# Altium project ARDUINO.PrjPcb (part 2 of 3)
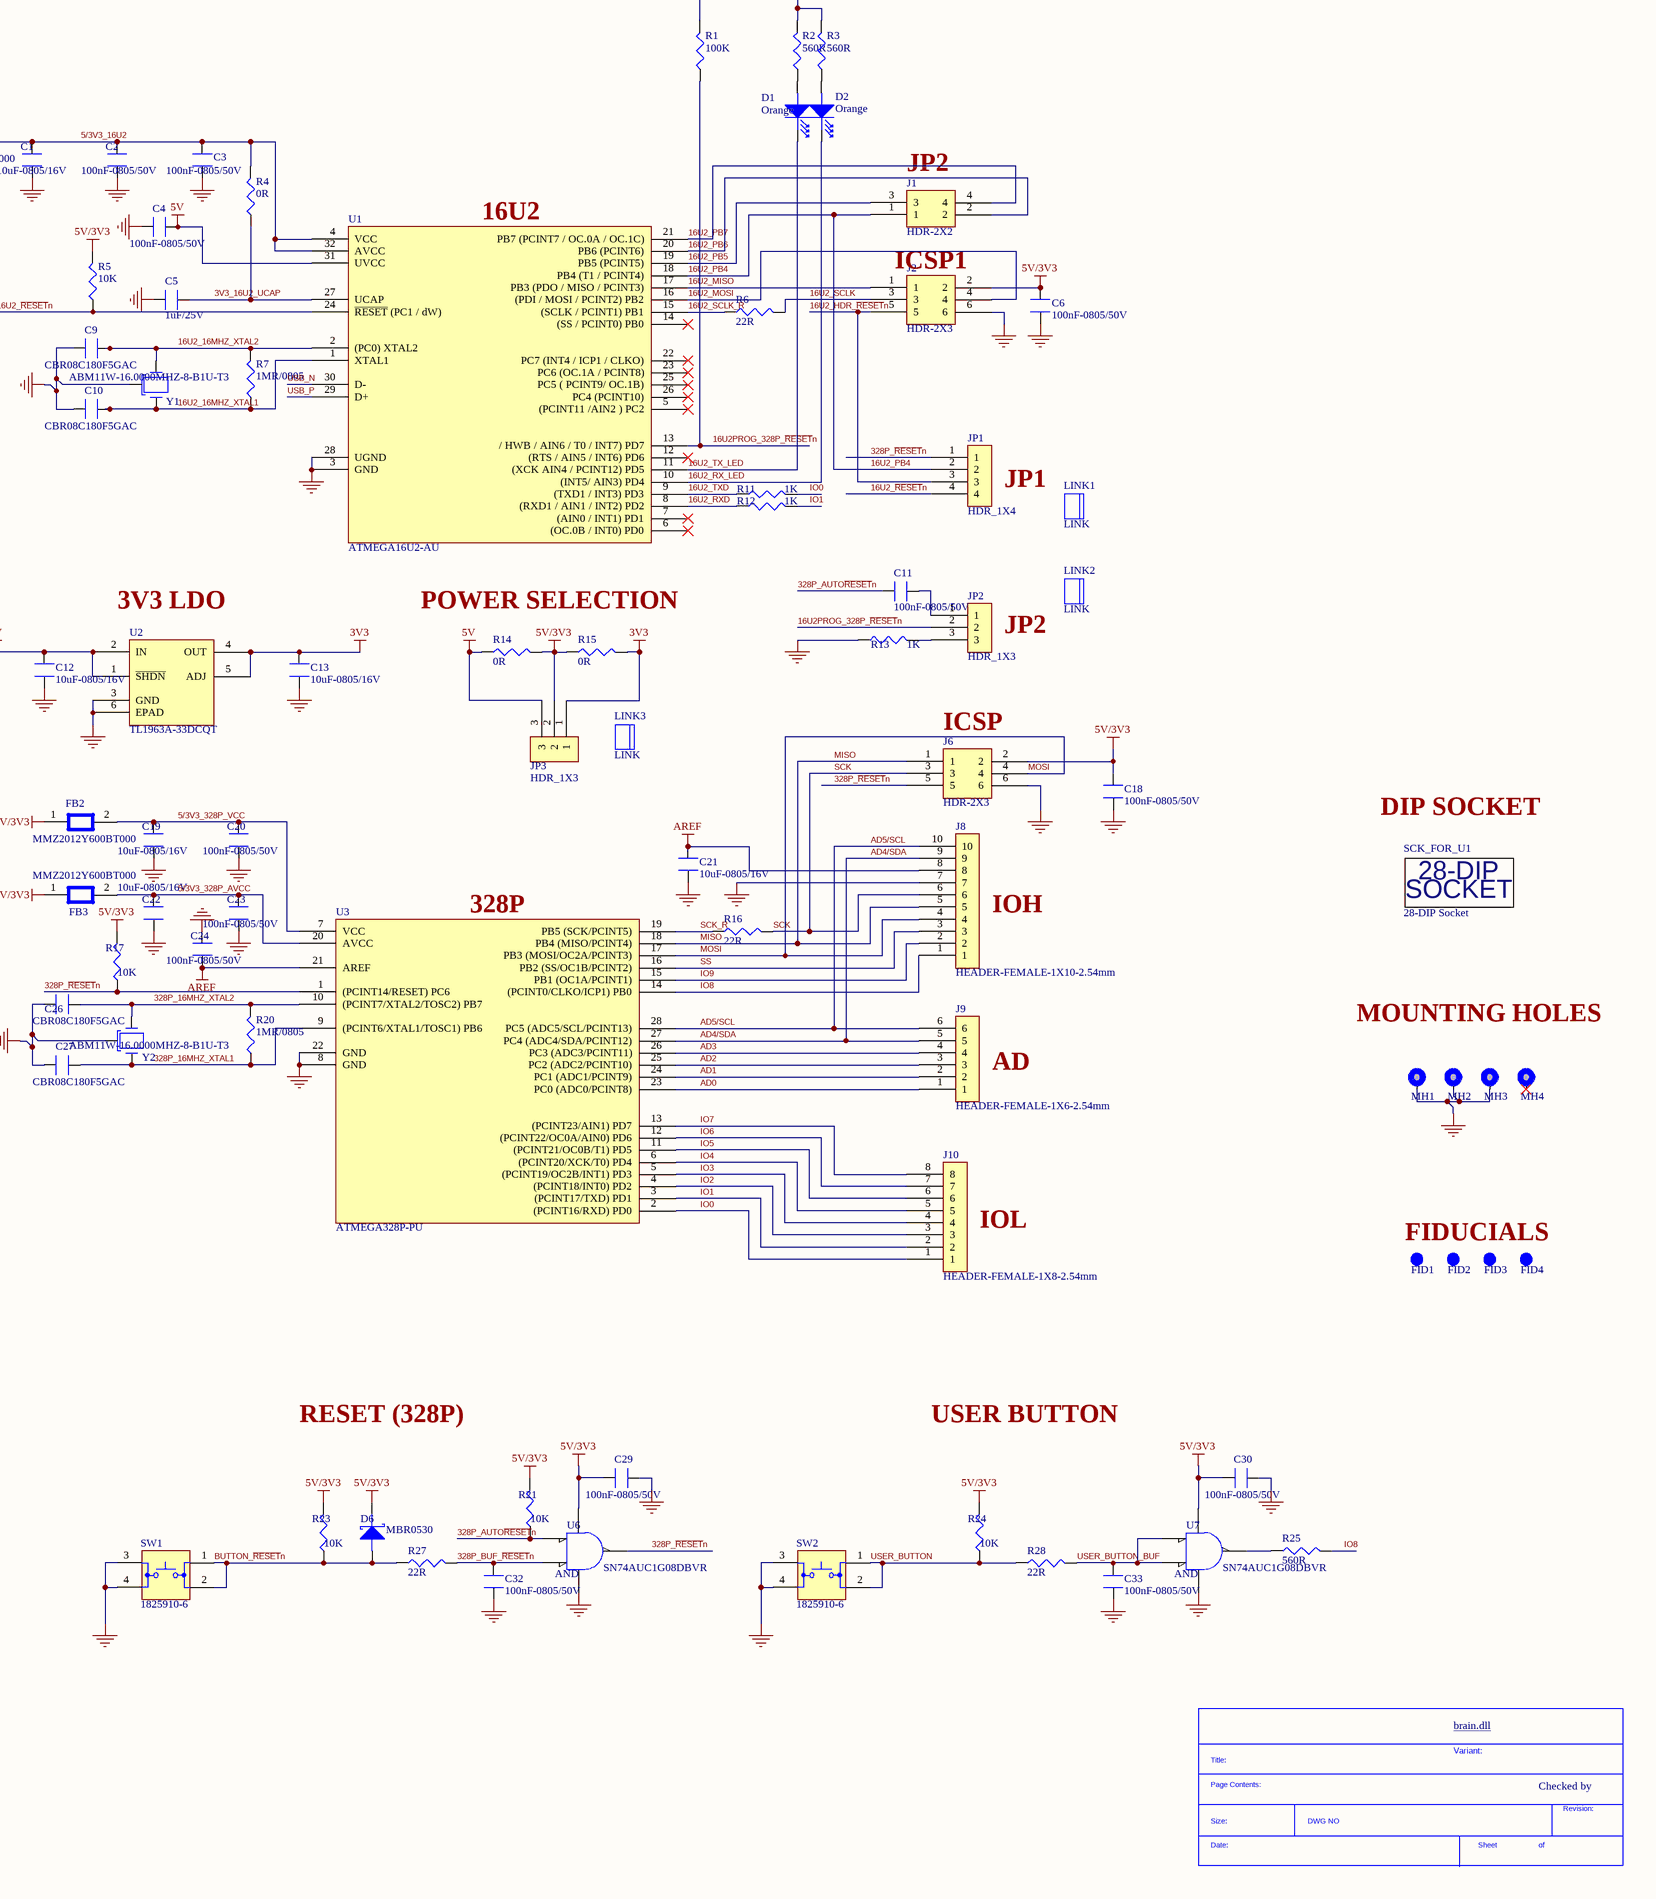
[diagram p6: [03] - 28PINS SCHEMATIC.SchDoc, bottom right]

## Sheet [03] - 28PINS SCHEMATIC.SchDoc: ARDUINO-28PIN (continued)
### Library data of the parts
C1 C12 C13 C17 C19 C21 C22 = C2012X5R1C106M085AC: TDK - C2012X5R1C106M085AC - SMD Multilayer Ceramic Capacitor, 10 µF, 16 V, 0805 [2012 Metric], ± 20%, X5R, C Series TDK; Capacitance: 10uF; Voltage Rating: 16V; Supplier 1: Digi-Key; Manufacturer: TDK; Manufacturer Part Number: C2012X5R1C106M085AC; RoHS: Yes; Category: Ceramic Capacitors; Stock 1: 53928; Pricing 1: 1=0,29000, 10=0,19800, 50=0,11900, 100=0,10050, 500=0,06876, 1000=0,06084 (USD); Mount: Surface Mount; Case/Package: 0805; Number of Pins: 2; Case Code (Metric): 2012; Case Code (Imperial): 0805; Weight: 0.000194oz; Dielectric Material: Ceramic; Min Operating Temperature: -55°C; Max Operating Temperature: 85°C; Packaging: Tape and Reel; Tolerance: 20%; Termination: SMD/SMT; Voltage Rating (DC): 16V; Package Quantity: 4000; Resistor Type: Ceramic; Dielectric: X5R; Voltage: 16V; Length: 2mm; Width: 0.049inch; Height: 0.85mm; Thickness: 0.037inch; Depth: 1.25mm; Lead Free: Lead Free; REACH SVHC: No SVHC; ComponentLink1URL: https://datasheet.ciiva.com/24218/c2012x5r1c106m085ac-265002-24218340.pdf?src-supplier=Mouser; ComponentLink1Description: https://datasheet.ciiva.com/24218/c2012x5r1c106m085ac-265002-24218340.pdf?src-supplier=Mouser; ComponentLink2URL: https://datasheet.ciiva.com/11788/0900766b80c1bb00-11788108.pdf?src-supplier=RSComponents; ComponentLink2Description: https://datasheet.ciiva.com/11788/0900766b80c1bb00-11788108.pdf?src-supplier=RSComponents; ComponentLink3URL: https://datasheet.ciiva.com/6290/tdkmlcccaprange-6290485.pdf?src-supplier=Digi-Key; ComponentLink3Description: https://datasheet.ciiva.com/6290/tdkmlcccaprange-6290485.pdf?src-supplier=Digi-Key; ComponentLink4URL: https://datasheet.ciiva.com/22725/1913358-22725557.pdf?src-supplier=Element14; ComponentLink4Description: https://datasheet.ciiva.com/22725/1913358-22725557.pdf?src-supplier=Element14; ComponentLink5URL: https://datasheet.ciiva.com/6290/tdkmlcccaprange-6290487.pdf?src-supplier=Digi-Key; ComponentLink5Description: https://datasheet.ciiva.com/6290/tdkmlcccaprange-6290487.pdf?src-supplier=Digi-Key; ComponentLink6URL: https://datasheet.ciiva.com/16449/e412-c-16449591.pdf?src-supplier=Future+Electronics; ComponentLink6Description: https://datasheet.ciiva.com/16449/e412-c-16449591.pdf?src-supplier=Future+Electronics; ComponentLink7URL: https://datasheet.ciiva.com/23803/1796654-23803021.pdf?src-supplier=Newark; ComponentLink7Description: https://datasheet.ciiva.com/23803/1796654-23803021.pdf?src-supplier=Newark; Supplier Part Number 1: 445-7645-1-ND
C2-C4 C6 C11 C14-C16 C18 C20 C23-C25 C28-C33 = C2012X7R1H104K125AE: Ceramic Capacitor, Multilayer, Ceramic, 50V, 10% +Tol, 10% -Tol, X7R, 15% TC, 0.1uF, Surface Mount, 0805; Manufacturer: TDK; Capacitance: 100nF; Supplier 1: Digi-Key; Manufacturer Part Number: C2012X7R1H104K125AE; RoHS: Yes; Category: Ceramic Capacitors; Stock 1: 3200; Pricing 1: 1=0,25000, 10=0,17200, 50=0,11440, 100=0,09720, 500=0,06864, 1000=0,06006 (USD); Mount: Surface Mount; Case/Package: 0805; Case Code (Metric): 2012; Case Code (Imperial): 0805; Weight: 0.000194oz; Min Operating Temperature: -55°C; Max Operating Temperature: 125°C; Package Quantity: 2000; Packaging: Tape and Reel; Tolerance: 10%; Voltage Rating: 50V; Dielectric: X7R; Termination: SMD/SMT; Voltage Rating (DC): 50V; Features: Soft Termination; Length: 0.079inch; Width: 0.049inch; Height: 1.25mm; Thickness: 0.057inch; RoHS Compliant: Yes; ComponentLink1URL: https://datasheet.ciiva.com/29534/mlcc-commercial-soft-en-29534235.pdf?src-supplier=Digi-Key; ComponentLink1Description: https://datasheet.ciiva.com/29534/mlcc-commercial-soft-en-29534235.pdf?src-supplier=Digi-Key; Supplier Part Number 1: 445-15929-1-ND
C5 = CGB4B3JB1E105K055AB: CAP CER 1UF 25V JB 0805; Manufacturer: TDK; Tolerance: 10%; Supplier 1: Digi-Key; Manufacturer Part Number: CGB4B3JB1E105K055AB; RoHS: Yes; Category: Ceramic Capacitors; Stock 1: 9451; Pricing 1: 1=0,38000, 10=0,26200, 50=0,17480, 100=0,14860, 500=0,10488, 1000=0,09177 (USD); Mount: Surface Mount; Case/Package: 0805; Case Code (Metric): 2012; Case Code (Imperial): 0805; Min Operating Temperature: -25°C; Max Operating Temperature: 85°C; Package Quantity: 4000; Packaging: Tape and Reel; Capacitance: 1uF; Voltage Rating: 25V; Series: CGB; Length: 0.079inch; Width: 0.049inch; Thickness: 0.022inch; RoHS Compliant: Yes; ComponentLink1URL: http://www.mouser.com/ds/2/400/tdk_mlcc_commercial_general_en-542463.pdf?src-supplier=Mouser; ComponentLink1Description: http://www.mouser.com/ds/2/400/tdk_mlcc_commercial_general_en-542463.pdf?src-supplier=Mouser; ComponentLink2URL: http://product.tdk.com/en/catalog/datasheets/mlcc_commercial_lowprofile_en.pdf?src-supplier=Avnet; ComponentLink2Description: http://product.tdk.com/en/catalog/datasheets/mlcc_commercial_lowprofile_en.pdf?src-supplier=Avnet; ComponentLink3URL: https://product.tdk.com/info/en/catalog/datasheets/mlcc_commercial_lowprofile_en.pdf?src-supplier=Digi-Key; ComponentLink3Description: https://product.tdk.com/info/en/catalog/datasheets/mlcc_commercial_lowprofile_en.pdf?src-supplier=Digi-Key; ComponentLink4URL: https://product.tdk.com/info/en/documents/chara_sheet/CGB4B3JB1E105K055AB.pdf?src-supplier=Digi-Key; ComponentLink4Description: https://product.tdk.com/info/en/documents/chara_sheet/CGB4B3JB1E105K055AB.pdf?src-supplier=Digi-Key; Supplier Part Number 1: 445-13262-1-ND
C7 C8 = EEE-HA1A101AP: Cap Aluminum Lytic 100uF 10V 20% (8 X 6.2mm) SMD 110mA 1000h 105C T/R; Manufacturer: Panasonic; Life (Hours): 1000Hour; Polarity: Polar; Supplier 1: Digi-Key; Manufacturer Part Number: EEE-HA1A101AP; RoHS: Yes; Category: Aluminum Electrolytic Capacitors; Stock 1: 351; Pricing 1: 1=0,57000, 10=0,40100, 50=0,30340, 100=0,26430 (USD); Mount: Surface Mount; Case/Package: Radial; Min Operating Temperature: -40°C; Max Operating Temperature: 105°C; Capacitance: 100uF; Voltage Rating: 10V; Tolerance: 20%; Ripple Current: 110mA; Packaging: Tape and Reel; Package Quantity: 1000; Voltage Rating (DC): 10V; Termination: SMD/SMT; Series: Automotive, AEC-Q200, HA; Construction: Cylindrical; Diameter: 8mm; Length: 6.5mm; Height: 6.2mm; Height - Seated (Max): 0.244inch; Radiation Hardening: No; RoHS Compliant: Yes; ComponentLink1URL: https://datasheet.ciiva.com/24070/aba0000ce3-259063-24070870.pdf?src-supplier=Mouser; ComponentLink1Description: https://datasheet.ciiva.com/24070/aba0000ce3-259063-24070870.pdf?src-supplier=Mouser; ComponentLink2URL: https://datasheet.ciiva.com/11680/aba0000ce3-11680519.pdf?src-supplier=Avnet; ComponentLink2Description: https://datasheet.ciiva.com/11680/aba0000ce3-11680519.pdf?src-supplier=Avnet; Supplier Part Number 1: PCE4650CT-ND
C9 C10 C26 C27 = CBR08C180F5GAC: CAP CER 18PF 50V NP0 0805; Manufacturer: KEMET; Tolerance: 1%; Dielectric: C0G; Supplier 1: Digi-Key; Manufacturer Part Number: CBR08C180F5GAC; RoHS: Yes; Category: Ceramic Capacitors; Stock 1: 2495; Pricing 1: 1=1,11000, 10=0,84100, 50=0,69860, 100=0,60150, 500=0,46570, 1000=0,40102 (USD); Mount: Surface Mount; Case/Package: 0805; Contact Plating: Tin,Matte; Min Operating Temperature: -55°C; Max Operating Temperature: 125°C; Packaging: Tape and Reel; Package Quantity: 4000; Capacitance: 18pF; Voltage Rating: 50V; Termination: Wraparound; Series: CBR; Construction: Flat; Length: 0.079inch; Width: 0.049inch; Thickness: 0.035inch; RoHS Compliant: Yes; ComponentLink1URL: https://datasheet.ciiva.com/6262/kem-c1030-cbr-smd-6262511.pdf?src-supplier=Digi-Key; ComponentLink1Description: https://datasheet.ciiva.com/6262/kem-c1030-cbr-smd-6262511.pdf?src-supplier=Digi-Key; Supplier Part Number 1: 399-17327-1-ND
D1-D3 = LOL29K-H2K1-24-Z: OSRAM - LO L29K-H2K1-24-Z - SMARTLED 0603 ORANGE 55AC2374; Manufacturer: Osram Opto; Lens Color: White; Forward Current: 20mA; Forward Voltage: 2.2V; Luminous Intensity: 9mcd; Viewing Angle: 160°; Lens Style: Flat,Diffused,Colorless,Rectangular; Test Current: 2mA; Dominant Wavelength: 606nm; Luminous Flux: 0.025lm; Number of LEDs: 1; Reverse Voltage: 12V; Lens Transparency: Diffused; Lens Size: 0.8mm; Supplier 1: Arrow Electronics; Manufacturer Part Number: LOL29K-H2K1-24-Z; RoHS: Yes; Category: Uncategorized; Mount: Surface Mount; Case/Package: 0603; Number of Pins: 2; Color: Orange; Case Code (Metric): 1608; Case Code (Imperial): 0603; Min Operating Temperature: -40°C; Max Operating Temperature: 100°C; Packaging: Tape and Reel; Number of Elements: 1; Series: SmartLED; Illumination Color: Orange; Package Quantity: 5000; Length: 1.3mm; Width: 0.8mm; Height: 0.65mm; Depth: 0.8mm; Radiation Hardening: No; RoHS Compliant: Yes; ComponentLink1URL: https://datasheet.ciiva.com/2112/00077105-0-2112905.pdf?src-supplier=Digi-Key; ComponentLink1Description: https://datasheet.ciiva.com/2112/00077105-0-2112905.pdf?src-supplier=Digi-Key; ComponentLink2URL: https://datasheet.ciiva.com/2112/00077105-0-2112904.pdf?src-supplier=Digi-Key; ComponentLink2Description: https://datasheet.ciiva.com/2112/00077105-0-2112904.pdf?src-supplier=Digi-Key; ComponentLink3URL: https://datasheet.ciiva.com/2112/00077105-0-2112906.pdf?src-supplier=Digi-Key; ComponentLink3Description: https://datasheet.ciiva.com/2112/00077105-0-2112906.pdf?src-supplier=Digi-Key; ComponentLink4URL: https://datasheet.ciiva.com/15198/getdatasheetpartid-693885-15198412.pdf?src-supplier=Verical; ComponentLink4Description: https://datasheet.ciiva.com/15198/getdatasheetpartid-693885-15198412.pdf?src-supplier=Verical; Supplier Part Number 1: LO L29K-H2K1-24-Z
D4 = LTQ39E-Q1OO-25-1: LED GREEN DIFFUSED 0603 SMD; Manufacturer: Osram Opto; Lens Color: White; Lens Style: Flat,Diffused,Colorless,Rectangular; Viewing Angle: 130°; Luminous Intensity: 175.5mcd; Forward Current: 15mA; Forward Voltage: 2.85V; Luminous Flux: 0.34lm; Test Current: 5mA; Dominant Wavelength: 530nm; Number of Elements: 1; Lens Size: 0.8mm; Supplier 1: Digi-Key; Manufacturer Part Number: LTQ39E-Q1OO-25-1; RoHS: Yes; Category: LEDs; Stock 1: 4572; Pricing 1: 1=0,42000, 10=0,27400, 100=0,18280, 500=0,12644, 1000=0,10536, 2000=0,09483 (USD); Mount: Surface Mount; Case/Package: SMD/SMT; Number of Pins: 2; Color: Green; Case Code (Imperial): 0603; Case Code (Metric): 1608; Min Operating Temperature: -40°C; Max Operating Temperature: 85°C; Packaging: Tape and Reel; Number of LEDs: 1; Lens Transparency: Diffused; Package Quantity: 16000; Series: CHIPLED 0603; Length: 1.6mm; Width: 0.8mm; Depth: 0.9mm; Radiation Hardening: No; RoHS Compliant: Yes; ComponentLink1URL: http://www.mouser.com/ds/2/311/LT%20Q39E%20-%20CHIPLED%200603-318171.pdf?src-supplier=Mouser; ComponentLink1Description: http://www.mouser.com/ds/2/311/LT%20Q39E%20-%20CHIPLED%200603-318171.pdf?src-supplier=Mouser; ComponentLink2URL: http://components.arrow.com/part/dataview/48286240S9138660N2128?src-supplier=Arrow+Electronics; ComponentLink2Description: http://components.arrow.com/part/dataview/48286240S9138660N2128?src-supplier=Arrow+Electronics; ComponentLink3URL: https://dammedia.osram.info/media/resource/hires/osram-dam-2493475/LT%20Q39E.pdf?src-supplier=Digi-Key; ComponentLink3Description: https://dammedia.osram.info/media/resource/hires/osram-dam-2493475/LT%20Q39E.pdf?src-supplier=Digi-Key; ComponentLink4URL: http://www.osram-os.com/Graphics/XPic7/00185661_0.pdf?src-supplier=Digi-Key; ComponentLink4Description: http://www.osram-os.com/Graphics/XPic7/00185661_0.pdf?src-supplier=Digi-Key; ComponentLink5URL: http://catalog.osram-os.com/jsp/download.jsp?rootPath=/media/&name=LB_LT_Q39E.pdf&docPath=Graphics/00052413_0.pdf&url=/media//_en/Graphics/00052413_0.pdf&src-supplier=Avnet; ComponentLink5Description: http://catalog.osram-os.com/jsp/download.jsp?rootPath=/media/&name=LB_LT_Q39E.pdf&docPath=Graphics/00052413_0.pdf&url=/media//_en/Graphics/00052413_0.pdf&src-supplier=Avnet; ComponentLink6URL: http://www.osram-os.com/Graphics/XPic7/00185661_0.pdf/LT%20Q39E%20-%20CHIPLED%200603.pdf?src-supplier=Avnet; ComponentLink6Description: http://www.osram-os.com/Graphics/XPic7/00185661_0.pdf/LT%20Q39E%20-%20CHIPLED%200603.pdf?src-supplier=Avnet; Supplier Part Number 1: 475-3441-1-ND
D5 D6 = MBR0530: DIODE SCHOTTKY 30V 500MA SOD123; Manufacturer: ON Semiconductor / Fairchild; Element Configuration: Single; Max Surge Current: 5.5A; Max Reverse Leakage Current: 130uA; Forward Voltage: 430mV; Polarity: Standard; Supplier 1: Newark; Manufacturer Part Number: MBR0530; RoHS: Yes; Category: Schottky Diodes; Stock 1: 10; Pricing 1: 1=0,34400, 10=0,23900, 100=0,12200, 500=0,10000 (USD); Mount: Surface Mount; Number of Pins: 2; Contact Plating: Tin,Matte; Weight: 0.03g; Min Operating Temperature: -65°C; Max Operating Temperature: 150°C; Packaging: Tape and Reel; Package Quantity: 1; Peak Non-Repetitive Surge Current: 5.5A; Average Rectified Current: 500mA; Max Reverse Voltage (DC): 30V; Forward Current: 500mA; Max Reverse Current: 130uA; Max Repetitive Reverse Voltage (Vrrm): 30V; Max Forward Surge Current (Ifsm): 5.5A; Voltage Rating (DC): 30V; Current Rating: 500mA; Output Current: 500mA; Series: -; Length: 2.7mm; Width: 1.6mm; Height: 1.03mm; Radiation Hardening: No; RoHS Compliant: Yes; REACH SVHC: No SVHC; Lead Free: Lead Free; ComponentLink1URL: https://datasheet.ciiva.com/30479/0900766b810e2512-30479401.pdf?src-supplier=RSComponents; ComponentLink1Description: https://datasheet.ciiva.com/30479/0900766b810e2512-30479401.pdf?src-supplier=RSComponents; ComponentLink2URL: https://datasheet.ciiva.com/34301/974753-34301826.pdf?src-supplier=Jameco; ComponentLink2Description: https://datasheet.ciiva.com/34301/974753-34301826.pdf?src-supplier=Jameco; ComponentLink3URL: https://datasheet.ciiva.com/910/mbr0530-910516.pdf?src-supplier=Digi-Key; ComponentLink3Description: https://datasheet.ciiva.com/910/mbr0530-910516.pdf?src-supplier=Digi-Key; ComponentLink4URL: https://datasheet.ciiva.com/25931/mbr0530-25931989.pdf?src-supplier=Avnet+Europe; ComponentLink4Description: https://datasheet.ciiva.com/25931/mbr0530-25931989.pdf?src-supplier=Avnet+Europe; ComponentLink5URL: https://datasheet.ciiva.com/8300/mbr0530-8300905.pdf?src-supplier=Avnet; ComponentLink5Description: https://datasheet.ciiva.com/8300/mbr0530-8300905.pdf?src-supplier=Avnet; ComponentLink6URL: https://datasheet.ciiva.com/17318/mbr0530-17318568.pdf?src-supplier=Future+Electronics; ComponentLink6Description: https://datasheet.ciiva.com/17318/mbr0530-17318568.pdf?src-supplier=Future+Electronics; ComponentLink7URL: https://datasheet.ciiva.com/15144/getdatasheetpartid-86760-15144598.pdf?src-supplier=Verical; ComponentLink7Description: https://datasheet.ciiva.com/15144/getdatasheetpartid-86760-15144598.pdf?src-supplier=Verical; ComponentLink8URL: https://datasheet.ciiva.com/910/mbr0530-910518.pdf?src-supplier=Digi-Key; ComponentLink8Description: https://datasheet.ciiva.com/910/mbr0530-910518.pdf?src-supplier=Digi-Key; Supplier Part Number 1: 15R3453
FB1-FB3 = MMZ2012Y600BT000: TDK         MMZ2012Y600BT000             FERRITE BEAD, 60 OHM, 1A, 0805; Tolerance: 25%; Impedance: 60R; DC Resistance (DCR): 100mR; Supplier 1: Digi-Key; Manufacturer: TDK; Manufacturer Part Number: MMZ2012Y600BT000; RoHS: Yes; Category: Ferrite Beads and Chips; Stock 1: 10400; Pricing 1: 1=0,11000, 10=0,08800, 25=0,07920, 50=0,05800, 100=0,05020, 250=0,03960, 500=0,03344, 1000=0,02816 (USD); Mount: Surface Mount; Case/Package: 0805; Core Material: Ferrite; Case Code (Metric): 2012; Case Code (Imperial): 0805; Current Rating: 1A; Package Quantity: 4000; Packaging: Tape and Reel; Max DC Current: 1A; Length: 0.079inch; Width: 0.049inch; Height: 0.041inch; Depth: 1.25mm; RoHS Compliant: Yes; REACH SVHC: No SVHC; ComponentLink1URL: https://datasheet.ciiva.com/46634/beads-commercial-signal-mmz-en-46634486.pdf?src-supplier=Digi-Key; ComponentLink1Description: https://datasheet.ciiva.com/46634/beads-commercial-signal-mmz-en-46634486.pdf?src-supplier=Digi-Key; ComponentLink2URL: https://datasheet.ciiva.com/46634/beads-commercial-signal-mmz-en-46634489.pdf?src-supplier=Digi-Key; ComponentLink2Description: https://datasheet.ciiva.com/46634/beads-commercial-signal-mmz-en-46634489.pdf?src-supplier=Digi-Key; ComponentLink3URL: https://datasheet.ciiva.com/46634/beads-commercial-signal-mmz-en-46634603.pdf?src-supplier=Digi-Key; ComponentLink3Description: https://datasheet.ciiva.com/46634/beads-commercial-signal-mmz-en-46634603.pdf?src-supplier=Digi-Key; ComponentLink4URL: https://datasheet.ciiva.com/48682/beads-commercial-signal-mmz-en-48682571.pdf?src-supplier=Avnet; ComponentLink4Description: https://datasheet.ciiva.com/48682/beads-commercial-signal-mmz-en-48682571.pdf?src-supplier=Avnet; Supplier Part Number 1: 445-2204-1-ND
FID1-FID4 = FID-1MMC: Fiducial 40 mil Diameter, 120 mil Mask
J1 = TSW-102-23-S-D: CONN HEADER 4POS .100 DUAL GOLD; Manufacturer: Samtec; Number of Contacts: 4; Gender: Male; Max Voltage Rating (AC): 550V; Max Current Rating: 7.6A; Connector Type: Male Pin; Pitch: 2.54mm; Row Spacing: 0.1inch; Supplier 1: Digi-Key; Manufacturer Part Number: TSW-102-23-S-D; RoHS: Yes; Category: Connectors; Stock 1: 382; Pricing 1: 1=0,66000, 10=0,61800, 25=0,55600, 50=0,49420, 100=0,47360, 250=0,43244, 500=0,41184 (USD); Mount: Through Hole; Contact Plating: Gold; Housing Color: Black; Contact Material: Bronze; Housing Material: Plastic; Color: Black; Min Operating Temperature: -55°C; Max Operating Temperature: 125°C; Number of Rows: 2; Packaging: Bulk; Termination: Solder; Orientation: Straight; Number of Positions: 4; Series: TSW; Contact Type: Male Pin; Length: 5.08mm; Width: 5.08mm; Height: 2.54mm; Contact Mating Length: 0.23inch; Radiation Hardening: No; RoHS Compliant: Yes; Lead Free: Lead Free; ComponentLink1URL: https://datasheet.ciiva.com/6863/tsw-xxx-xx-xxx-x-xx-xxx-mkt-6863142.pdf?src-supplier=Digi-Key; ComponentLink1Description: https://datasheet.ciiva.com/6863/tsw-xxx-xx-xxx-x-xx-xxx-mkt-6863142.pdf?src-supplier=Digi-Key; ComponentLink2URL: https://datasheet.ciiva.com/10190/htsw-th-10190190.pdf?src-supplier=Avnet; ComponentLink2Description: https://datasheet.ciiva.com/10190/htsw-th-10190190.pdf?src-supplier=Avnet; Supplier Part Number 1: SAM1072-02-ND
J2 J6 = TSW-103-06-T-D: SAMTEC         TSW-103-06-T-D             Board-To-Board Connector, Vertical, TSW Series, 6 Contacts, Header, 2.54 mm, Through Hole, 2 Rows; Number of Contacts: 6; Gender: Male; Max Current Rating: 7.6A; Max Voltage Rating (AC): 550V; Connector Type: Male Pin; Pitch: 2.54mm; Row Spacing: 0.1inch; Supplier 1: Digi-Key; Manufacturer: Samtec; Manufacturer Part Number: TSW-103-06-T-D; RoHS: Yes; Category: Headers and Wire Housings; Stock 1: 1730; Pricing 1: 1=0,50000, 10=0,42300, 100=0,32930, 500=0,28224, 1000=0,23520, 5000=0,20160, 10000=0,18816 (USD); Mount: Through Hole; Contact Plating: Tin; Contact Material: Bronze; Housing Color: Black; Housing Material: Polyester; Color: Black; Min Operating Temperature: -55°C; Max Operating Temperature: 105°C; Number of Rows: 2; Packaging: Bulk; Termination: Solder; Orientation: Straight; Series: TSW; Package Quantity: 1; Number of Positions: 6; Contact Type: Male Pin; Length: 7.62mm; Width: 5.08mm; Depth: 5.08mm; Contact Mating Length: 0.105inch; Radiation Hardening: No; RoHS Compliant: Yes; REACH SVHC: No SVHC; Lead Free: Lead Free; ComponentLink1URL: https://datasheet.ciiva.com/16722/htsw-th-16722934.pdf?src-supplier=Avnet+Europe; ComponentLink1Description: https://datasheet.ciiva.com/16722/htsw-th-16722934.pdf?src-supplier=Avnet+Europe; Supplier Part Number 1: TSW-103-06-T-D-ND
J3 = 10118193-0001LF: CONN USB MICRO B RECPT SMT R/A; Manufacturer: Amphenol ICC / FCI; Supplier 1: Digi-Key; Manufacturer Part Number: 10118193-0001LF; RoHS: No; Category: USB Connectors; Stock 1: 217493; Pricing 1: 1=0,45000, 10=0,39700, 25=0,36240, 50=0,34120, 100=0,32700, 250=0,29856, 500=0,28434 (USD); ComponentLink1URL: http://components.arrow.com/part/dataview/0323_04107372?src-supplier=Arrow+Europe; ComponentLink1Description: http://components.arrow.com/part/dataview/0323_04107372?src-supplier=Arrow+Europe; ComponentLink2URL: http://uk.rs-online.com/webdocs/1450/0900766b814507f1.pdf?src-supplier=RSComponents; ComponentLink2Description: http://uk.rs-online.com/webdocs/1450/0900766b814507f1.pdf?src-supplier=RSComponents; ComponentLink3URL: https://cdn.amphenol-icc.com/media/wysiwyg/files/documentation/datasheet/inputoutput/io_usb_micro.pdf?src-supplier=Avnet; ComponentLink3Description: https://cdn.amphenol-icc.com/media/wysiwyg/files/documentation/datasheet/inputoutput/io_usb_micro.pdf?src-supplier=Avnet; ComponentLink4URL: https://cdn.amphenol-icc.com/media/wysiwyg/files/documentation/datasheet/inputoutput/io_usb_micro.pdf?src-supplier=Arrow+Electronics; ComponentLink4Description: https://cdn.amphenol-icc.com/media/wysiwyg/files/documentation/datasheet/inputoutput/io_usb_micro.pdf?src-supplier=Arrow+Electronics; ComponentLink5URL: https://cdn.amphenol-icc.com/media/wysiwyg/files/documentation/datasheet/inputoutput/io_usb_micro.pdf?src-supplier=Onlinecomponents.com; ComponentLink5Description: https://cdn.amphenol-icc.com/media/wysiwyg/files/documentation/datasheet/inputoutput/io_usb_micro.pdf?src-supplier=Onlinecomponents.com; ComponentLink6URL: https://cdn.amphenol-icc.com/media/wysiwyg/files/documentation/datasheet/inputoutput/io_usb_micro.pdf?src-supplier=Verical; ComponentLink6Description: https://cdn.amphenol-icc.com/media/wysiwyg/files/documentation/datasheet/inputoutput/io_usb_micro.pdf?src-supplier=Verical; ComponentLink7URL: http://www.amphenol-icc.com/media/wysiwyg/files/drawing/10118193.pdf?src-supplier=Digi-Key; ComponentLink7Description: http://www.amphenol-icc.com/media/wysiwyg/files/drawing/10118193.pdf?src-supplier=Digi-Key; ComponentLink8URL: https://cdn.amphenol-icc.com/media/wysiwyg/files/documentation/datasheet/inputoutput/io_usb_micro.pdf?src-supplier=Digi-Key; ComponentLink8Description: https://cdn.amphenol-icc.com/media/wysiwyg/files/documentation/datasheet/inputoutput/io_usb_micro.pdf?src-supplier=Digi-Key; ComponentLink9URL: https://cdn.amphenol-icc.com/media/wysiwyg/files/documentation/datasheet/inputoutput/io_usb_micro.pdf?src-supplier=Mouser; ComponentLink9Description: https://cdn.amphenol-icc.com/media/wysiwyg/files/documentation/datasheet/inputoutput/io_usb_micro.pdf?src-supplier=Mouser; ComponentLink10URL: https://cdn.amphenol-icc.com/media/wysiwyg/files/documentation/datasheet/inputoutput/io_usb_micro.pdf?src-supplier=Allied+Electronics; ComponentLink10Description: https://cdn.amphenol-icc.com/media/wysiwyg/files/documentation/datasheet/inputoutput/io_usb_micro.pdf?src-supplier=Allied+Electronics; ComponentLink11URL: https://cdn.amphenol-icc.com/media/wysiwyg/files/documentation/datasheet/inputoutput/io_usb_micro.pdf?src-supplier=RSComponents; ComponentLink11Description: https://cdn.amphenol-icc.com/media/wysiwyg/files/documentation/datasheet/inputoutput/io_usb_micro.pdf?src-supplier=RSComponents; ComponentLink12URL: https://cdn.amphenol-icc.com/media/wysiwyg/files/documentation/datasheet/inputoutput/io_usb_micro.pdf?src-supplier=TTI; ComponentLink12Description: https://cdn.amphenol-icc.com/media/wysiwyg/files/documentation/datasheet/inputoutput/io_usb_micro.pdf?src-supplier=TTI; ComponentLink13URL: https://cdn.amphenol-icc.com/media/wysiwyg/files/documentation/datasheet/inputoutput/io_usb_micro.pdf?src-supplier=TME; ComponentLink13Description: https://cdn.amphenol-icc.com/media/wysiwyg/files/documentation/datasheet/inputoutput/io_usb_micro.pdf?src-supplier=TME; ComponentLink14URL: https://cdn.amphenol-icc.com/media/wysiwyg/files/documentation/datasheet/inputoutput/io_usb_micro.pdf?src-supplier=Heilind+Electronics; ComponentLink14Description: https://cdn.amphenol-icc.com/media/wysiwyg/files/documentation/datasheet/inputoutput/io_usb_micro.pdf?src-supplier=Heilind+Electronics; Supplier Part Number 1: 609-4616-1-ND
J4 J5 = PAD_WITH_HOLE_4MMX1.5MM: Pad with a hole 4mm x 1.5mm
J7 J10 = PPTC081LFBN-RC: CONN HDR 8POS 0.1 TIN PCB; Manufacturer: Sullins; Number of Positions: 8; Connector Type: Header; Pitch: 0.1inch; Supplier 1: Digi-Key; Manufacturer Part Number: PPTC081LFBN-RC; RoHS: Yes; Category: Connectors; Stock 1: 76748; Pricing 1: 1=0,65000, 10=0,56500, 400=0,42525, 800=0,36450, 1200=0,33413, 5200=0,29363, 10000=0,29250 (USD); Mount: Through Hole; Color: Black; Contact Plating: Tin; Contact Material: Bronze; Housing Material: Plastic; Package Quantity: 1000; Number of Rows: 1; Packaging: Bulk; Termination: Solder; Contact Type: Female Socket; Length: 20.8mm; Width: 2.5mm; Height: 8.5mm; Lead Free: Lead Free; RoHS Compliant: Yes; ComponentLink1URL: https://media.digikey.com/pdf/Data%20Sheets/Sullins%20PDFs/Female_Headers.100_DS.pdf?src-supplier=Digi-Key; ComponentLink1Description: https://media.digikey.com/pdf/Data%20Sheets/Sullins%20PDFs/Female_Headers.100_DS.pdf?src-supplier=Digi-Key; ComponentLink2URL: http://www.sullinscorp.com/catalogs/78_Page80-81_HEADER_.100_2.54mm_FEMALE.pdf?src-supplier=Future+Electronics; ComponentLink2Description: http://www.sullinscorp.com/catalogs/78_Page80-81_HEADER_.100_2.54mm_FEMALE.pdf?src-supplier=Future+Electronics; Supplier Part Number 1: S7006-ND
J8 = PPPC101LFBN-RC: CONN HDR 10POS 0.1 GOLD PCB; Manufacturer: Sullins; Number of Positions: 10; Connector Type: Header,Socket; Pitch: 0.1inch; Supplier 1: Digi-Key; Manufacturer Part Number: PPPC101LFBN-RC; RoHS: Yes; Category: Connectors; Stock 1: 33225; Pricing 1: 1=0,68000, 10=0,57100, 80=0,51288, 440=0,41959, 1000=0,37296, 5000=0,33670 (USD); Mount: Through Hole; Color: Black; Contact Material: Bronze; Housing Material: Plastic; Contact Plating: Gold; Number of Rows: 1; Packaging: Bulk; Termination: Solder; Package Quantity: 1000; Length: 25.9mm; Width: 2.5mm; Height: 8.5mm; Lead Free: Lead Free; ComponentLink1URL: https://media.digikey.com/pdf/Data%20Sheets/Sullins%20PDFs/Female_Headers.100_DS.pdf?src-supplier=Digi-Key; ComponentLink1Description: https://media.digikey.com/pdf/Data%20Sheets/Sullins%20PDFs/Female_Headers.100_DS.pdf?src-supplier=Digi-Key; ComponentLink2URL: http://www.sullinscorp.com/catalogs/78_Page80-81_HEADER_.100_2.54mm_FEMALE.pdf?src-supplier=Future+Electronics; ComponentLink2Description: http://www.sullinscorp.com/catalogs/78_Page80-81_HEADER_.100_2.54mm_FEMALE.pdf?src-supplier=Future+Electronics; Supplier Part Number 1: S7043-ND
J9 = PPPC061LFBN-RC: CONN HDR 6POS 0.1 GOLD PCB; Manufacturer: Sullins; Connector Type: Header,Socket; Number of Positions: 6; Pitch: 0.1inch; Supplier 1: Digi-Key; Manufacturer Part Number: PPPC061LFBN-RC; RoHS: Yes; Category: Connectors; Stock 1: 33601; Pricing 1: 1=0,53000, 10=0,46500, 80=0,38300, 440=0,33300, 1000=0,27472, 5000=0,24142, 10000=0,24050 (USD); Mount: Through Hole; Color: Black; Contact Plating: Gold; Housing Material: Plastic; Contact Material: Bronze; Package Quantity: 1000; Number of Rows: 1; Packaging: Bulk; Termination: Solder; Length: 15.7mm; Width: 2.5mm; Height: 8.5mm; Lead Free: Lead Free; ComponentLink1URL: https://media.digikey.com/pdf/Data%20Sheets/Sullins%20PDFs/Female_Headers.100_DS.pdf?src-supplier=Digi-Key; ComponentLink1Description: https://media.digikey.com/pdf/Data%20Sheets/Sullins%20PDFs/Female_Headers.100_DS.pdf?src-supplier=Digi-Key; Supplier Part Number 1: S7039-ND
JP1 = 68002-204HLF: CONN HEADER 4POS .100 STR 15AU; Manufacturer: Amphenol ICC / FCI; Voltage Rating: 1.5kV; Number of Positions: 4; Gender: Male; Connector Type: Male Pin; Current Rating: 3A; Insulation Resistance: 5GR; Pitch: 2.54mm; Contact Post Length: 3.81mm; Supplier 1: Digi-Key; Manufacturer Part Number: 68002-204HLF; RoHS: Yes; Category: Headers and Wire Housings; Stock 1: 1822; Pricing 1: 1=0,38000, 10=0,32200, 100=0,25080, 500=0,21498, 1000=0,17916, 5000=0,15356, 10000=0,14333 (USD); Mount: Through Hole; Color: Black; Housing Color: Black; Housing Material: Thermoplastic; Contact Plating: Gold,GXT; Contact Material: Bronze; Min Operating Temperature: -65°C; Max Operating Temperature: 125°C; Package Quantity: 100; Number of Rows: 1; Packaging: Bulk; Contact Gender: Male; Termination: Solder; Number of Contacts: 4; Max Voltage Rating (AC): 1.5kV; Orientation: Straight; Series: BERGSTIK® II, MezzSelect™, Basics+; Contact Type: Male Pin; Length: 10.16mm; Depth: 2.41mm; Contact Mating Length: 0.23inch; Radiation Hardening: No; RoHS Compliant: Yes; ComponentLink1URL: https://datasheet.ciiva.com/5163/68000-274406-5163449.pdf?src-supplier=Mouser; ComponentLink1Description: https://datasheet.ciiva.com/5163/68000-274406-5163449.pdf?src-supplier=Mouser; ComponentLink2URL: https://datasheet.ciiva.com/728/68000-728887.pdf?src-supplier=Digi-Key; ComponentLink2Description: https://datasheet.ciiva.com/728/68000-728887.pdf?src-supplier=Digi-Key; ComponentLink3URL: https://datasheet.ciiva.com/10149/68000-10149881.pdf?src-supplier=Avnet; ComponentLink3Description: https://datasheet.ciiva.com/10149/68000-10149881.pdf?src-supplier=Avnet; Supplier Part Number 1: 609-3298-ND
JP2 JP3 = PR20203VBNN: METZ CONNECT - PR20203VBNN - CONNECTOR, HEADER, 3POS, 1ROW, 2.54MM; Supplier 1: Digi-Key; Manufacturer: METZ CONNECT; Manufacturer Part Number: PR20203VBNN; RoHS: No; Category: Headers and Wire Housings; Stock 1: 23360; Pricing 1: 1=0,10000, 10=0,05000, 100=0,03650, 500=0,03024, 1000=0,02646, 5000=0,02268, 10000=0,02205 (USD); ComponentLink1URL: http://www.farnell.com/datasheets/2372088.pdf?src-supplier=Farnell; ComponentLink1Description: http://www.farnell.com/datasheets/2372088.pdf?src-supplier=Farnell; ComponentLink2URL: https://www.metz-connect.com/us/system/files/productfiles/Data_sheet_PR202XXVBNN_PR202XXVBNN_OFF-024022P.pdf?src-supplier=Digi-Key; ComponentLink2Description: https://www.metz-connect.com/us/system/files/productfiles/Data_sheet_PR202XXVBNN_PR202XXVBNN_OFF-024022P.pdf?src-supplier=Digi-Key; ComponentLink3URL: http://www.farnell.com/datasheets/2372088.pdf?src-supplier=Newark; ComponentLink3Description: http://www.farnell.com/datasheets/2372088.pdf?src-supplier=Newark; Supplier Part Number 1: 1849-1003-ND
L1 = L1210R2R2MDWIT: FIXED IND 2.2UH 2A 80 MOHM SMD; Manufacturer: KEMET; Core Material: Ferrite; Tolerance: 20%; Shielding: Unshielded; Self Resonant Frequency: 190MHz; DC Resistance (DCR): 80mR; Test Frequency: 100kHz; DC Current: 1.13A; Supplier 1: Digi-Key; Manufacturer Part Number: L1210R2R2MDWIT; RoHS: Yes; Category: Fixed Inductors; Stock 1: 15679; Pricing 1: 1=0,50000, 10=0,43700, 25=0,40600, 50=0,34360, 100=0,31240, 250=0,29364, 500=0,26240 (USD); Mount: Surface Mount; Case/Package: 1210; Case Code (Metric): 3225; Case Code (Imperial): 1210; Min Operating Temperature: -40°C; Max Operating Temperature: 105°C; Inductance: 2.2uH; Max DC Current: 2A; Package Quantity: 1000; Current Rating: 2A; Packaging: Tape and Reel; Inductance Tolerance: 20%; Resistor Type: Wirewound,Ceramic; Termination: SMD/SMT; Series: L-DWI; Length: 0.126inch; Width: 0.098inch; Height: 2.5mm; Height - Seated (Max): 0.106inch; Depth: 2.7mm; Radiation Hardening: No; REACH SVHC: No SVHC; Military Standard: Not; RoHS Compliant: Yes; ComponentLink1URL: https://datasheet.ciiva.com/4957/f3115-4957838.pdf?src-supplier=Mouser; ComponentLink1Description: https://datasheet.ciiva.com/4957/f3115-4957838.pdf?src-supplier=Mouser; ComponentLink2URL: https://datasheet.ciiva.com/6691/f3115-6691487.pdf?src-supplier=Digi-Key; ComponentLink2Description: https://datasheet.ciiva.com/6691/f3115-6691487.pdf?src-supplier=Digi-Key; ComponentLink3URL: https://datasheet.ciiva.com/8512/f3115-8512543.pdf?src-supplier=Avnet; ComponentLink3Description: https://datasheet.ciiva.com/8512/f3115-8512543.pdf?src-supplier=Avnet; ComponentLink4URL: https://datasheet.ciiva.com/17280/f3115-17280270.pdf?src-supplier=Avnet+Europe; ComponentLink4Description: https://datasheet.ciiva.com/17280/f3115-17280270.pdf?src-supplier=Avnet+Europe; ComponentLink5URL: https://datasheet.ciiva.com/22685/27262-22685038.pdf?src-supplier=Element14; ComponentLink5Description: https://datasheet.ciiva.com/22685/27262-22685038.pdf?src-supplier=Element14; Supplier Part Number 1: 399-9598-1-ND
LINK1-LINK3 = QPC02SXGN-RC: CONN JUMPER SHORTING .100" GOLD; Manufacturer: Sullins; Number of Positions: 2; Pitch: 0.1inch; Supplier 1: Digi-Key; Manufacturer Part Number: QPC02SXGN-RC; RoHS: Yes; Category: Connectors; Stock 1: 613321; Pricing 1: 1=0,10000, 10=0,05000, 25=0,04080, 50=0,03780, 100=0,03650, 250=0,03152, 500=0,03024, 1000=0,02646, 2500=0,02394 (USD); Case/Package: 100; Contact Plating: Gold; Package Quantity: 2000; Packaging: Bulk; Height: 0.235inch; Lead Free: Lead Free; ComponentLink1URL: https://datasheet.ciiva.com/767/284-sxgn-11510-767869.pdf?src-supplier=Digi-Key; ComponentLink1Description: https://datasheet.ciiva.com/767/284-sxgn-11510-767869.pdf?src-supplier=Digi-Key; Supplier Part Number 1: S9337-ND
MH1-MH3 = MH_7.4MMC_3.2MMD: Mounting Hole 7.4 mm Diameter, 3.2 mm Drill
MH4 = MH_7.4MMNC_3.2MMD: Mounting Hole 7.4 mm Diameter (Non Copper), 3.2 mm Drill NPTH
R1 = AC0805FR-07100KL: Res Thick Film 0805 100K Ohm 1% 1/8W ±100ppm/°C Molded SMD SMD Paper T/R; Manufacturer: Yageo; Resistance: 100kR; Power Rating: 125mW; Voltage Rating: 150V; Supplier 1: Digi-Key; Manufacturer Part Number: AC0805FR-07100KL; RoHS: Yes; Category: Chip SMD Resistors; Stock 1: 19074; Pricing 1: 1=0,10000, 10=0,05000, 100=0,02040, 1000=0,00917, 2500=0,00796 (USD); Case/Package: 0805; Contact Plating: Tin,Matte; Case Code (Imperial): 0805; Case Code (Metric): 2012; Size Code: 0805; Min Operating Temperature: -55°C; Max Operating Temperature: 155°C; Tolerance: 1%; Resistor Type: Thick Film; Temperature Coefficient: 100ppm/°C; Packaging: Tape and Reel; Number of Terminations: 2; Termination: SMD/SMT; Max Power Dissipation: 125mW; Features: Moisture Resistant,Automotive AEC-Q200; Series: AC; Length: 0.079inch; Width: 0.049inch; Height: 0.024inch; Radiation Hardening: No; Lead Free: Lead Free; RoHS Compliant: Yes; ComponentLink1URL: http://www.mouser.com/ds/2/447/yageodocoutput-1111992.pdf?src-supplier=Mouser; ComponentLink1Description: http://www.mouser.com/ds/2/447/yageodocoutput-1111992.pdf?src-supplier=Mouser; ComponentLink2URL: http://www.yageo.com/documents/recent/PYu-AC_51_RoHS_L_2_revised.pdf?src-supplier=Future+Electronics; ComponentLink2Description: http://www.yageo.com/documents/recent/PYu-AC_51_RoHS_L_2_revised.pdf?src-supplier=Future+Electronics; ComponentLink3URL: http://www.yageo.com/NewPortal/yageodocoutput?fileName=/pdf/R-Chip/PYu-AC_51_RoHS_L_6.pdf&src-supplier=Digi-Key; ComponentLink3Description: http://www.yageo.com/NewPortal/yageodocoutput?fileName=/pdf/R-Chip/PYu-AC_51_RoHS_L_6.pdf&src-supplier=Digi-Key; ComponentLink4URL: http://www.yageo.com/documents/recent/PYu-AC_51_RoHS_L_2_revised.pdf?src-supplier=Avnet+Europe; ComponentLink4Description: http://www.yageo.com/documents/recent/PYu-AC_51_RoHS_L_2_revised.pdf?src-supplier=Avnet+Europe; Supplier Part Number 1: YAG3688CT-ND
R2 R3 R18 R19 R25 = AC0805FR-07560RL: Thick Film Resistors - SMD 1/8W 560ohm 1% AEC-Q200; Manufacturer: Yageo; Voltage Rating: 150V; Power Rating: 125mW; Temperature Coefficient: 100ppm/°C; Supplier 1: Digi-Key; Manufacturer Part Number: AC0805FR-07560RL; RoHS: Yes; Category: Chip SMD Resistors; Stock 1: 1319; Pricing 1: 1=0,10000, 10=0,05000, 100=0,02040, 1000=0,00917, 2500=0,00796 (USD); Case/Package: 0805; Case Code (Imperial): 0805; Case Code (Metric): 2012; Weight: 0.000194oz; Min Operating Temperature: -55°C; Max Operating Temperature: 155°C; Resistance: 560R; Tolerance: 1%; Packaging: Tape and Reel; Resistor Type: Thick Film; Number of Terminations: 2; Termination: SMD/SMT; Max Power Dissipation: 125mW; Features: Moisture Resistant,Automotive AEC-Q200; Series: AC; Length: 0.079inch; Width: 0.049inch; Height: 0.024inch; RoHS Compliant: Yes; ComponentLink1URL: https://datasheet.ciiva.com/12576/pyu-ac-51-rohs-l-2-12576701.pdf?src-supplier=Mouser; ComponentLink1Description: https://datasheet.ciiva.com/12576/pyu-ac-51-rohs-l-2-12576701.pdf?src-supplier=Mouser; Supplier Part Number 1: YAG3743CT-ND
R4 R10 R14 R15 = RC0805FR-070RL: Res Thick Film 0805 0 Ohm Epoxy Pad SMD T/R; Manufacturer: Yageo; Resistance: 0mR; Tolerance: 1%; Power Rating: 125mW; Supplier 1: Digi-Key; Manufacturer Part Number: RC0805FR-070RL; RoHS: Yes; Category: Chip SMD Resistors; Stock 1: 312891; Pricing 1: 1=0,10000, 10=0,03200, 25=0,02360, 50=0,01780, 100=0,01320, 250=0,01004, 500=0,00802, 1000=0,00591 (USD); Case/Package: 0805; Contact Plating: Tin,Matte; Case Code (Imperial): 0805; Case Code (Metric): 2012; Size Code: 0805; Min Operating Temperature: -55°C; Max Operating Temperature: 155°C; Resistor Type: Thick Film; Packaging: Tape and Reel; Features: Moisture Resistant; Series: RC; Max Power Dissipation: 125mW; Number of Terminations: 2; Construction: Rectangular; Length: 2mm; Depth: 1.25mm; Radiation Hardening: No; Military Standard: Not; Lead Free: Lead Free; RoHS Compliant: Yes; ComponentLink1URL: https://datasheet.ciiva.com/17042/rc0805-17042698.pdf?src-supplier=Future+Electronics; ComponentLink1Description: https://datasheet.ciiva.com/17042/rc0805-17042698.pdf?src-supplier=Future+Electronics; ComponentLink2URL: https://datasheet.ciiva.com/15189/getdatasheetpartid-348154-15189885.pdf?src-supplier=Verical; ComponentLink2Description: https://datasheet.ciiva.com/15189/getdatasheetpartid-348154-15189885.pdf?src-supplier=Verical; Supplier Part Number 1: 311-0.0CRCT-ND
R5 R17 R21-R24 = SR0805JR-0710KL: RES SMD 10K OHM 5% 1/8W 0805; Manufacturer: Yageo; Resistance: 10kR; Power Rating: 125mW; Voltage Rating: 150V; Temperature Coefficient: 200ppm/°C; Supplier 1: Digi-Key; Manufacturer Part Number: SR0805JR-0710KL; RoHS: Yes; Category: Chip SMD Resistors; Stock 1: 9830; Pricing 1: 1=0,25000, 10=0,21100, 100=0,08260, 1000=0,03458, 2500=0,03170 (USD); Case/Package: 0805; Case Code (Metric): 2012; Case Code (Imperial): 0805; Min Operating Temperature: -55°C; Max Operating Temperature: 155°C; Package Quantity: 1; Tolerance: 5%; Packaging: Tape and Reel; Resistor Type: Thick Film; Number of Terminations: 2; Termination: SMD/SMT; Max Power Dissipation: 125mW; Features: Automotive AEC-Q200; Series: SR; Length: 0.079inch; Width: 0.049inch; Height: 0.024inch; RoHS Compliant: Yes; ComponentLink1URL: https://datasheet.ciiva.com/2471/pyu-sr-20105-rohs-l-1-2471968.pdf?src-supplier=Digi-Key; ComponentLink1Description: https://datasheet.ciiva.com/2471/pyu-sr-20105-rohs-l-1-2471968.pdf?src-supplier=Digi-Key; ComponentLink2URL: https://datasheet.ciiva.com/5558/pyu-sr-20105-rohs-l-1-5558104.pdf?src-supplier=Mouser; ComponentLink2Description: https://datasheet.ciiva.com/5558/pyu-sr-20105-rohs-l-1-5558104.pdf?src-supplier=Mouser; Supplier Part Number 1: 13-SR0805JR-0710KLCT-ND
R6 R8 R9 R16 R26-R28 = RC0805JR-0722RL: Res Thick Film 0805 22 Ohm 5% 1/8W 100ppm/C Molded SMD SMD Paper T/R; Manufacturer: Yageo; Temperature Coefficient: 100ppm/°C; Power Rating: 125mW; Voltage Rating: 150V; Supplier 1: Digi-Key; Manufacturer Part Number: RC0805JR-0722RL; RoHS: Yes; Category: Chip SMD Resistors; Stock 1: 938662; Pricing 1: 1=0,10000, 10=0,03600, 100=0,01450, 1000=0,00652, 2500=0,00566 (USD); Case/Package: 0805; Contact Plating: Tin,Matte,Lead; Case Code (Imperial): 0805; Case Code (Metric): 2012; Min Operating Temperature: -55°C; Max Operating Temperature: 155°C; Resistor Type: Thick Film; Tolerance: 5%; Resistance: 22R; Termination: SMD/SMT; Packaging: Tape and Reel; Length: 2mm; Depth: 1.25mm; Radiation Hardening: No; Military Standard: Not; Lead Free: Lead Free; REACH SVHC: Unknown; ComponentLink1URL: http://www.mouser.com/ds/2/447/Yageo_08112016_RC0805-968729.pdf?src-supplier=Mouser; ComponentLink1Description: http://www.mouser.com/ds/2/447/Yageo_08112016_RC0805-968729.pdf?src-supplier=Mouser; ComponentLink2URL: http://www.farnell.com/datasheets/2167052.pdf?src-supplier=Farnell; ComponentLink2Description: http://www.farnell.com/datasheets/2167052.pdf?src-supplier=Farnell; ComponentLink3URL: http://components.arrow.com/part/dataview/0323_00047573?src-supplier=Arrow+Europe; ComponentLink3Description: http://components.arrow.com/part/dataview/0323_00047573?src-supplier=Arrow+Europe; ComponentLink4URL: http://www.farnell.com/datasheets/444164.pdf?src-supplier=Farnell; ComponentLink4Description: http://www.farnell.com/datasheets/444164.pdf?src-supplier=Farnell; ComponentLink5URL: http://www.yageo.ru/pdf/RC0805.pdf?src-supplier=Future+Electronics; ComponentLink5Description: http://www.yageo.ru/pdf/RC0805.pdf?src-supplier=Future+Electronics; ComponentLink6URL: http://www.yageo.com/documents/recent/PYu-RC_Group_51_RoHS_L_10.pdf?src-supplier=Digi-Key; ComponentLink6Description: http://www.yageo.com/documents/recent/PYu-RC_Group_51_RoHS_L_10.pdf?src-supplier=Digi-Key; ComponentLink7URL: http://www.farnell.com/datasheets/442941.pdf?src-supplier=Element14; ComponentLink7Description: http://www.farnell.com/datasheets/442941.pdf?src-supplier=Element14; ComponentLink8URL: http://www.yageo.com/documents/recent/PYu-RC_Group_51_RoHS_L_9.pdf?src-supplier=Digi-Key; ComponentLink8Description: http://www.yageo.com/documents/recent/PYu-RC_Group_51_RoHS_L_9.pdf?src-supplier=Digi-Key; ComponentLink9URL: http://www.yageo.com/pdf/PYu-RC0805_51_RoHS_L_4.pdf?src-supplier=Avnet; ComponentLink9Description: http://www.yageo.com/pdf/PYu-RC0805_51_RoHS_L_4.pdf?src-supplier=Avnet; ComponentLink10URL: http://www.farnell.com/datasheets/444164.pdf?src-supplier=Element14; ComponentLink10Description: http://www.farnell.com/datasheets/444164.pdf?src-supplier=Element14; ComponentLink11URL: http://www.farnell.com/datasheets/2167052.pdf?src-supplier=Newark; ComponentLink11Description: http://www.farnell.com/datasheets/2167052.pdf?src-supplier=Newark; ComponentLink12URL: http://www.yageo.com/documents/recent/PYu-RC0805_51_RoHS_L_5.pdf?src-supplier=Avnet+Europe; ComponentLink12Description: http://www.yageo.com/documents/recent/PYu-RC0805_51_RoHS_L_5.pdf?src-supplier=Avnet+Europe; Supplier Part Number 1: 311-22ARCT-ND
R7 R20 = RV0805FR-071ML: RES SMD 1M OHM 1% 1/8W 0805; Manufacturer: Yageo; Resistance: 1MR; Power Rating: 125mW; Voltage Rating: 400V; Temperature Coefficient: 200ppm/°C; Supplier 1: Digi-Key; Manufacturer Part Number: RV0805FR-071ML; RoHS: Yes; Category: Chip SMD Resistors; Stock 1: 4797; Pricing 1: 1=0,53000, 10=0,38100, 100=0,15240, 1000=0,07511, 2500=0,06959 (USD); Case/Package: 0805; Case Code (Metric): 2012; Case Code (Imperial): 0805; Min Operating Temperature: -55°C; Max Operating Temperature: 155°C; Package Quantity: 1; Tolerance: 1%; Packaging: Tape and Reel; Resistor Type: Thick Film; Number of Terminations: 2; Termination: SMD/SMT; Max Power Dissipation: 125mW; Features: Moisture Resistant; Series: RV; Length: 0.079inch; Width: 0.049inch; Height: 0.024inch; Lead Free: Lead Free; RoHS Compliant: Yes; ComponentLink1URL: https://datasheet.ciiva.com/5558/pyu-rv-51-rohs-l-2-5558239.pdf?src-supplier=Mouser; ComponentLink1Description: https://datasheet.ciiva.com/5558/pyu-rv-51-rohs-l-2-5558239.pdf?src-supplier=Mouser; Supplier Part Number 1: 311-1MNGCT-ND
R11-R13 = AC0805FR-071KL: RES SMD 1K OHM 1% 1/8W 0805; Manufacturer: Yageo; Resistance: 1kR; Power Rating: 125mW; Voltage Rating: 150V; Temperature Coefficient: 100ppm/°C; Supplier 1: Digi-Key; Manufacturer Part Number: AC0805FR-071KL; RoHS: Yes; Category: Chip SMD Resistors; Stock 1: 146950; Pricing 1: 1=0,10000, 10=0,05000, 100=0,02040, 1000=0,00917, 2500=0,00796 (USD); Case/Package: 0805; Case Code (Imperial): 0805; Case Code (Metric): 2012; Min Operating Temperature: -55°C; Max Operating Temperature: 155°C; Tolerance: 1%; Packaging: Tape and Reel; Termination: SMD/SMT; Resistor Type: Thick Film; Number of Terminations: 2; Max Power Dissipation: 125mW; Features: Moisture Resistant,Automotive AEC-Q200; Series: AC; Construction: Rectangular; Length: 2mm; Width: 1.25mm; Height: 0.024inch; Depth: 1.25mm; Military Standard: Not; Lead Free: Lead Free; RoHS Compliant: Yes; ComponentLink1URL: https://datasheet.ciiva.com/26829/getdatasheetpartid-732555-26829222.pdf?src-supplier=Verical; ComponentLink1Description: https://datasheet.ciiva.com/26829/getdatasheetpartid-732555-26829222.pdf?src-supplier=Verical; Supplier Part Number 1: YAG3703CT-ND
SCK_FOR_U1 = 4828-3004-CP: CONN IC DIP SOCKET 28POS TIN; Manufacturer: 3M; Number of Contacts: 28; Gender: Female; Insulation Resistance: 5GR; Connector Type: DIP,Socket; Current Rating: 1A; Pitch: 2.54mm; Row Spacing: 7.62mm; Supplier 1: Digi-Key; Manufacturer Part Number: 4828-3004-CP; RoHS: Yes; Category: Connectors; Stock 1: 3763; Pricing 1: 1=0,90000, 10=0,76200, 25=0,73040, 40=0,71500, 80=0,68388, 230=0,62174, 440=0,55959, 945=0,49741, 2400=0,45078 (USD); Mount: Through Hole; Contact Material: Bronze; Contact Plating: Tin; Housing Material: Glass; Min Operating Temperature: -25°C; Max Operating Temperature: 85°C; Termination: Solder; Orientation: Straight; Number of Rows: 2; Number of Positions: 28; Package Quantity: 5600; Length: 35.43mm; Width: 10.16mm; Depth: 5.08mm; REACH SVHC: Unknown; Lead Free: Lead Free; ComponentLink1URL: https://datasheet.ciiva.com/768/ts1099-768354.pdf?src-supplier=Digi-Key; ComponentLink1Description: https://datasheet.ciiva.com/768/ts1099-768354.pdf?src-supplier=Digi-Key; Supplier Part Number 1: 3M5480-ND
SW1 SW2 = 1825910-6: 6X6, H5,  160G TAC.SWITCH; Manufacturer: TE Connectivity Alcoswitch; Mechanical Life: 100000Cycles; Actuator Material: PBT; Actuator Color: Black; Throw Configuration: SPST; Max Current Rating: 50mA; Operating Force: 160gf; Illumination Type: Non-Illuminated,Illuminated; Switch Travel: 0.25mm; Switch Function: Off-Mom; Max Voltage Rating (DC): 24V; Contact Resistance: 100mR; Actuator Type: Standard; Actuator Length: 0.055inch; Supplier 1: Digi-Key; Manufacturer Part Number: 1825910-6; RoHS: Yes; Category: Pushbutton Switches; Stock 1: 138465; Pricing 1: 1=0,11000, 10=0,11100, 25=0,10520, 100=0,09550, 250=0,08980, 500=0,08216, 1000=0,06879, 2500=0,06688, 5000=0,06306 (USD); Mount: Through Hole; Contact Material: Copper Alloy; Contact Plating: Silver; Min Operating Temperature: -35°C; Max Operating Temperature: 85°C; Packaging: Loose Piece; Termination: PC Pins; Orientation: Straight; Contact Current Rating: 50mA; Type: Switch; Series: FSMJ; Package Quantity: 750; Electrical Life: 100000Cycles; Length: 5.99mm; RoHS Compliant: Yes; REACH SVHC: Unknown; ELV: Compliant; Lead Free: Lead Free; ComponentLink1URL: https://datasheet.ciiva.com/30199/1825910-6rqpn1825910-6-30199520.pdf?src-supplier=Onlinecomponents.com; ComponentLink1Description: https://datasheet.ciiva.com/30199/1825910-6rqpn1825910-6-30199520.pdf?src-supplier=Onlinecomponents.com; ComponentLink2URL: https://datasheet.ciiva.com/15184/getdatasheetpartid-395915-15184509.pdf?src-supplier=Verical; ComponentLink2Description: https://datasheet.ciiva.com/15184/getdatasheetpartid-395915-15184509.pdf?src-supplier=Verical; Supplier Part Number 1: 450-1650-ND
U1 = ATMEGA16U2-AU: MICROCHIP - ATMEGA16U2-AU - MCU, 8BIT, MEGAAVR, 16MHZ, TQFP-32; Manufacturer: Microchip / Atmel; Core Architecture: AVR; Interface: SPI,UART,USB,USART,Serial; Data Bus Width: 8b; Memory Type: FLASH; Memory Size: 16KB; RAM Size: 512B; Number of I/Os: 22; Number of Timers/Counters: 2; Max Supply Voltage: 5.5V; Min Supply Voltage: 2.7V; Oscillator Type: Internal; Watchdog Timer: Yes; Peripherals: Brown-out Detect/Reset,POR,PWM,WDT; Number of PWM Channels: 5; Number of SPI Channels: 1; Supplier 1: Arrow Electronics; Manufacturer Part Number: ATMEGA16U2-AU; RoHS: Yes; Category: Microcontrollers; Mount: Surface Mount; Case/Package: A; Number of Pins: 32; Contact Plating: Tin,Matte; Min Operating Temperature: -40°C; Max Operating Temperature: 85°C; Package Quantity: 1250; Frequency: 16MHz; Packaging: Tray; Number of Programmable I/O: 22; Max Frequency: 16MHz; Series: AVR® ATmega; Length: 7mm; Width: 7mm; Height: 1.05mm; REACH SVHC: No SVHC; Lead Free: Lead Free; RoHS Compliant: Yes; ComponentLink1URL: https://datasheet.ciiva.com/13036/doc7799-28769-13036800.pdf?src-supplier=Mouser; ComponentLink1Description: https://datasheet.ciiva.com/13036/doc7799-28769-13036800.pdf?src-supplier=Mouser; ComponentLink2URL: https://datasheet.ciiva.com/22651/doc7799-22651110.pdf?src-supplier=Farnell; ComponentLink2Description: https://datasheet.ciiva.com/22651/doc7799-22651110.pdf?src-supplier=Farnell; Supplier Part Number 1: ATMEGA16U2-AU